# EasyEDA schematic Schematic_AddKEYSTM32_EASYEDA.json
TITLE: addKey; REV: 2.2; Date: 2021-01-10; Sheet: 1/1; Drawn By: Volker Simon; Company: None
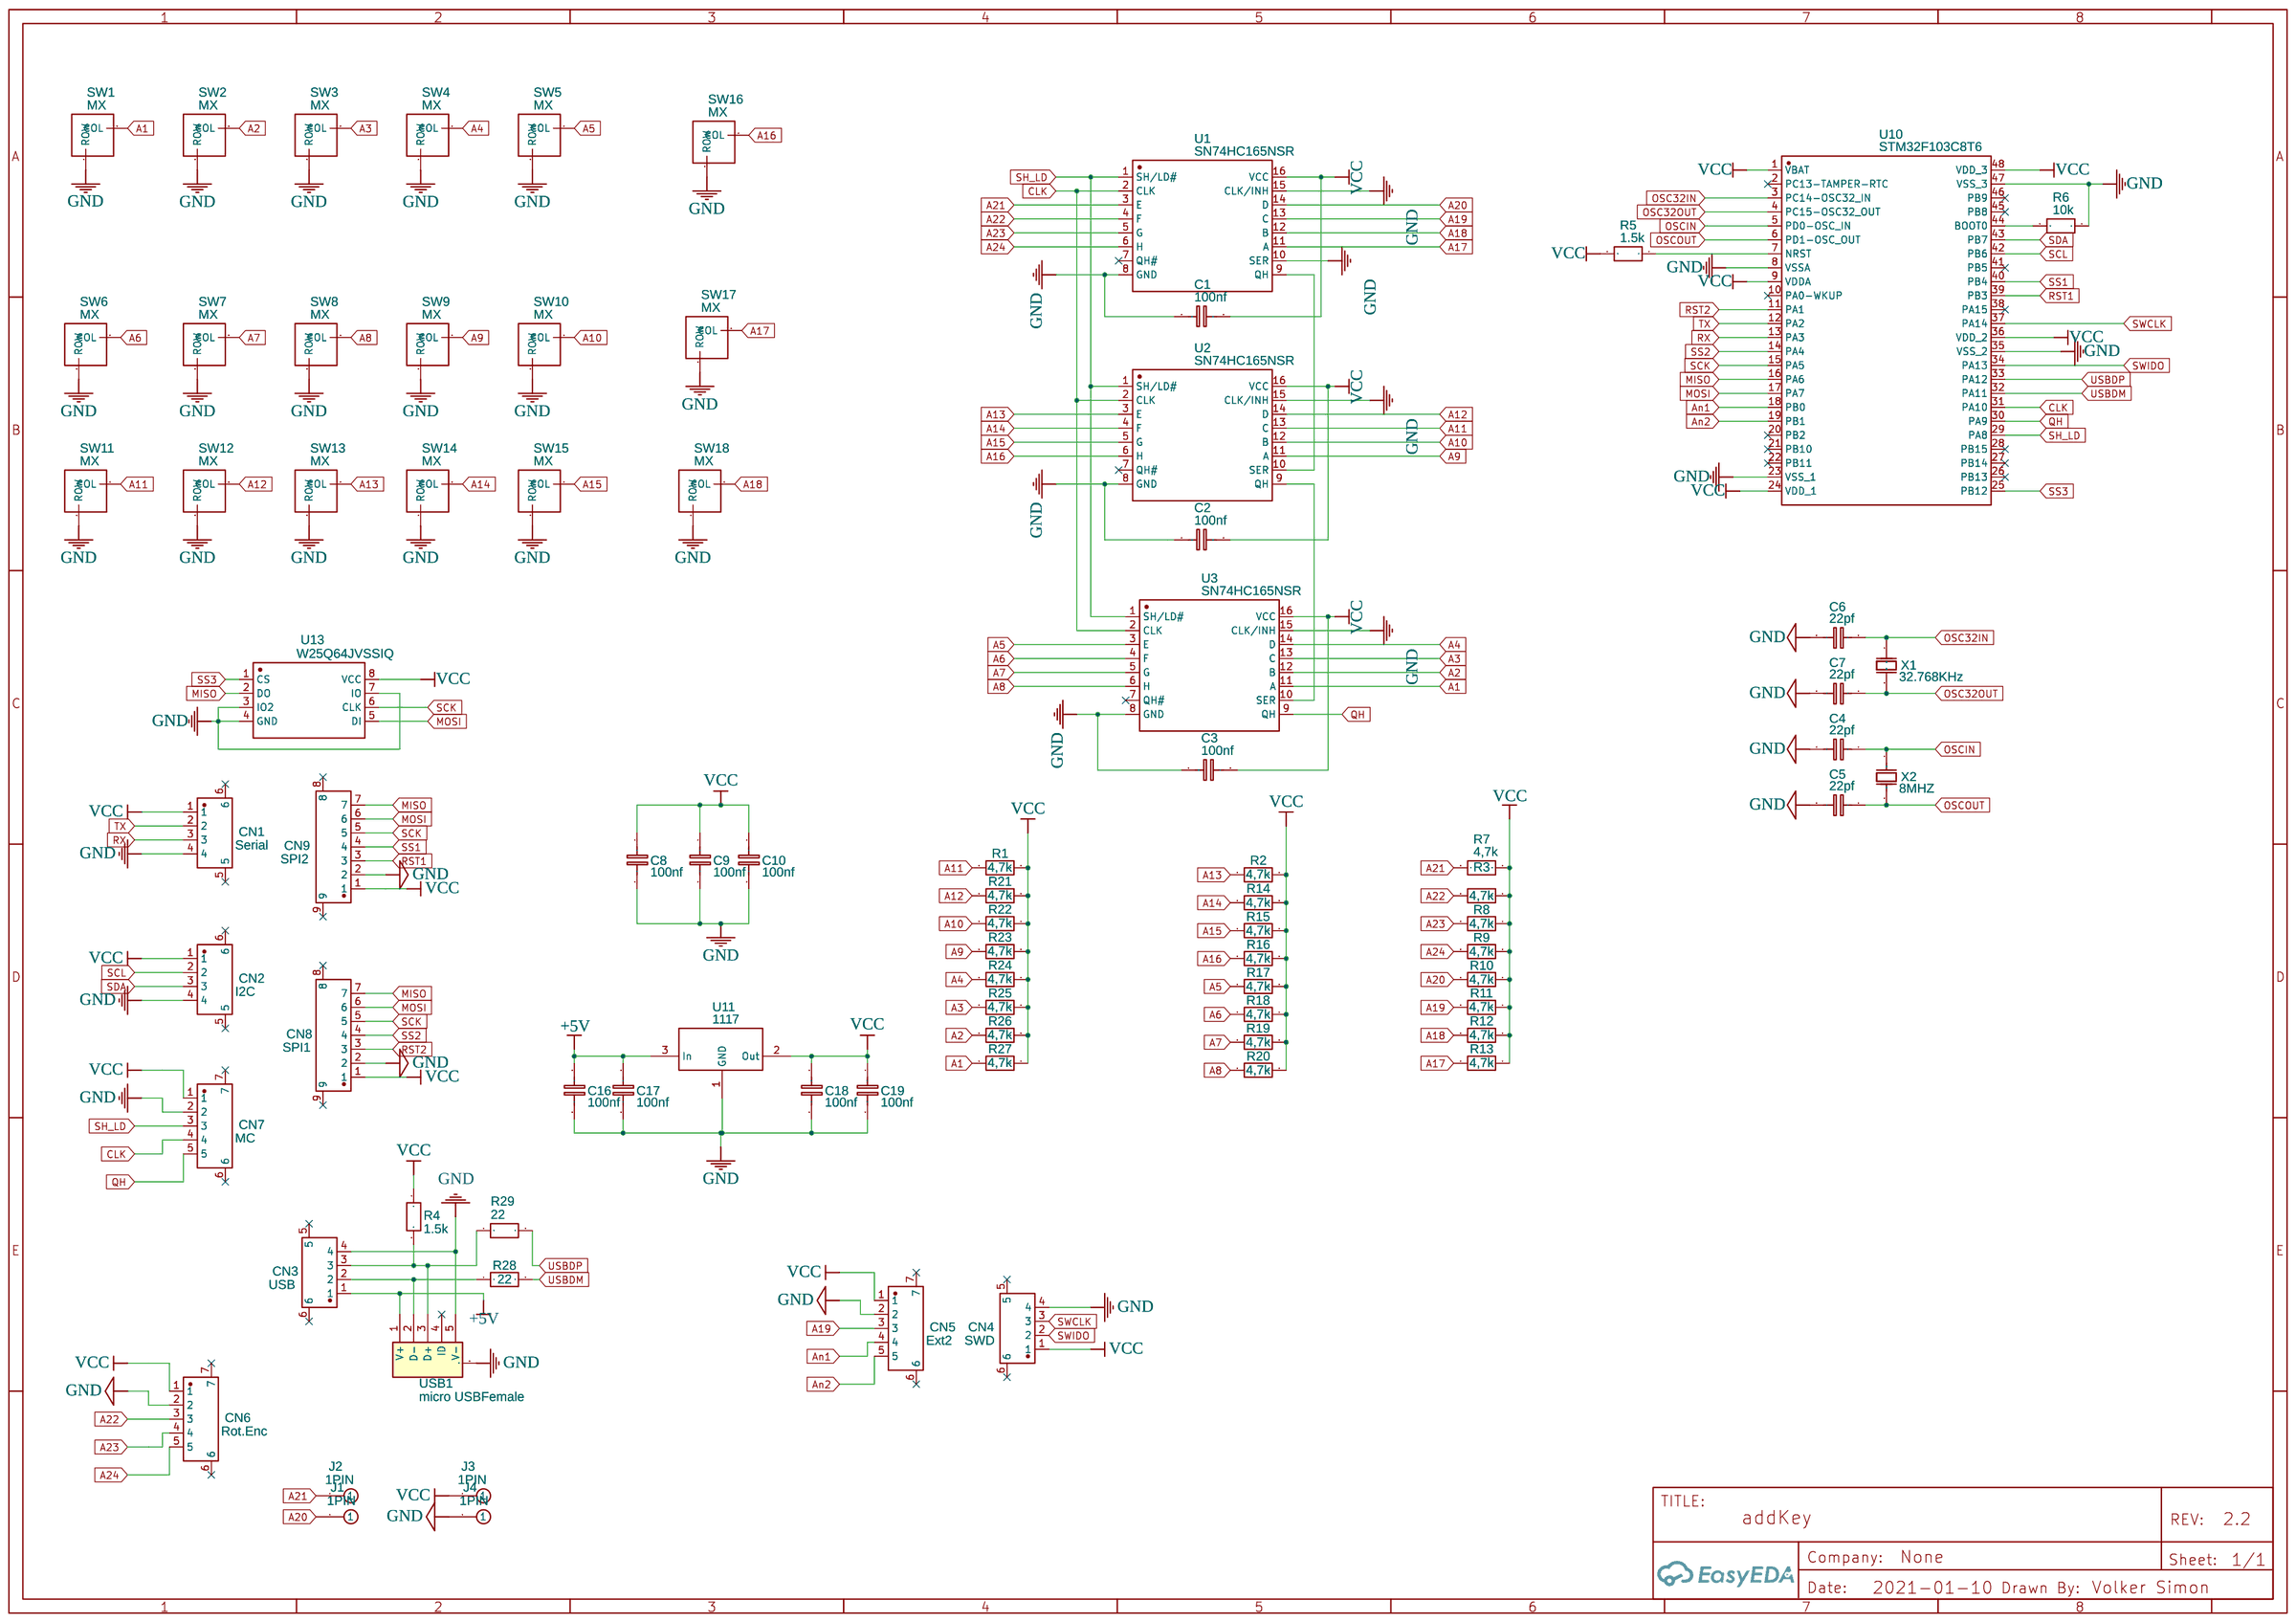
[diagram p0: schematic sheet]

## Parts
C1  100nf  [1206]
C2  100nf  [1206]
C3  100nf  [1206]
C4  22pf  [1206]
C5  22pf  [1206]
C6  22pf  [1206]
C7  22pf  [1206]
C8  100nf  [1206]
C9  100nf  [1206]
C10  100nf  [1206]
C16  100nf  [1206]
C17  100nf  [1206]
C18  100nf  [1206]
C19  100nf  [1206]
CN1  Serial  [CONN-SMD_4P-P1.00_X1002WRS-04E-LPSWHF]
CN2  I2C  [CONN-SMD_4P-P1.00_X1002WRS-04E-LPSWHF]
CN3  USB  [CONN-SMD_4P-P1.00_X1002WRS-04E-LPSWHF]
CN4  SWD  [CONN-SMD_4P-P1.00_X1002WRS-04E-LPSWHF]
CN5  Ext2  [CONN-SMD_5P-P1.00_X1002WRS-05E-LPSWHF]
CN6  Rot.Enc  [CONN-SMD_5P-P1.00_X1002WRS-05E-LPSWHF]
CN7  MC  [CONN-SMD_5P-P1.00_X1002WRS-05E-LPSWHF]
CN8  SPI1  [CONN-SMD_7P-P1.00_X1002WRS-07E-LPSWHF]
CN9  SPI2  [CONN-SMD_7P-P1.00_X1002WRS-07E-LPSWHF]
J1  1PIN  [1PIN]
J2  1PIN  [1PIN]
J3  1PIN  [1PIN]
J4  1PIN  [1PIN]
R1  4,7k  [R1206]
R2  4,7k  [R1206]
R3  4,7k  [R1206]
R4  1.5k  [R1206]
R5  1.5k  [R1206]
R6  10k  [R1206]
R7  4,7k  [R1206]
R8  4,7k  [R1206]
R9  4,7k  [R1206]
R10  4,7k  [R1206]
R11  4,7k  [R1206]
R12  4,7k  [R1206]
R13  4,7k  [R1206]
R14  4,7k  [R1206]
R15  4,7k  [R1206]
R16  4,7k  [R1206]
R17  4,7k  [R1206]
R18  4,7k  [R1206]
R19  4,7k  [R1206]
R20  4,7k  [R1206]
R21  4,7k  [R1206]
R22  4,7k  [R1206]
R23  4,7k  [R1206]
R24  4,7k  [R1206]
R25  4,7k  [R1206]
R26  4,7k  [R1206]
R27  4,7k  [R1206]
R28  22  [R1206]
R29  22  [R1206]
SW1  MX  [CHERRY MX SWITCH 1.0U]
SW2  MX  [CHERRY MX SWITCH 1.0U]
SW3  MX  [CHERRY MX SWITCH 1.0U]
SW4  MX  [CHERRY MX SWITCH 1.0U]
SW5  MX  [CHERRY MX SWITCH 1.0U]
SW6  MX  [CHERRY MX SWITCH 1.0U]
SW7  MX  [CHERRY MX SWITCH 1.0U]
SW8  MX  [CHERRY MX SWITCH 1.0U]
SW9  MX  [CHERRY MX SWITCH 1.0U]
SW10  MX  [CHERRY MX SWITCH 1.0U]
SW11  MX  [CHERRY MX SWITCH 1.0U]
SW12  MX  [CHERRY MX SWITCH 1.0U]
SW13  MX  [CHERRY MX SWITCH 1.0U]
SW14  MX  [CHERRY MX SWITCH 1.0U]
SW15  MX  [CHERRY MX SWITCH 1.0U]
SW16  MX  [CHERRY MX SWITCH 1.0U]
SW17  MX  [CHERRY MX SWITCH 1.0U]
SW18  MX  [CHERRY MX SWITCH 1.0U]
U1  SN74HC165NSR  [SOP-16_208MIL]
U2  SN74HC165NSR  [SOP-16_208MIL]
U3  SN74HC165NSR  [SOP-16_208MIL]
U10  STM32F103C8T6  [LQFP-48_L7.0-W7.0-P0.50-LS9.0-BL]
U11  1117  [AMS_1117]
U13  W25Q64JVSSIQ  [SOP-8_208MIL]
USB1  micro USBFemale  [MICRO-USB-SMD_5P-P0.65-H-F_C10418]
X1  32.768KHz  [OSC-TH_BD2.0-P0.70-D0.3]
X2  8MHZ  [HC-49S_L11.0-W4.6-P4.88]

## Library data of the parts
C1-C3 C8-C10 C16-C19 = Cap_1206_EU: Manufacturer Part: 1206F104M500NT; Supplier: LCSC; Manufacturer: Guangdong Fenghua Advanced Tech; Supplier Part: C313097
C4-C7 = Cap_1206_EU: Manufacturer Part: 1206CG220J102NT; Supplier: LCSC; Manufacturer: Guangdong Fenghua Advanced Tech; Supplier Part: C313096
CN1-CN4 = X1002WRS-04E-LPSWHF: Supplier: LCSC; Supplier Part: C437064; Manufacturer: XKB Enterprise; Contributor: LCSC
CN5-CN7 = X1002WRS-05E-LPSWHF: Supplier: LCSC; Supplier Part: C437065; Manufacturer: XKB Enterprise; Contributor: LCSC
CN8 CN9 = X1002WRS-07E-LPSWHF: Supplier: LCSC; Supplier Part: C437067; Manufacturer: XKB Enterprise; Contributor: LCSC
J1-J4 = 1PIN: Contributor: JoshuaFireseed
R1-R3 R7-R27 = Res_AXIAL-0.3(1/8W)_EU: Manufacturer Part: 1206W4F4701T5E; Package Display: No; Supplier: LCSC; Manufacturer: UniOhm; Supplier Part: C17936
R4-R6 R28 R29 = Res_AXIAL-0.3(1/8W)_EU: Package Display: No
SW1-SW18 = CHERRY MX SWITCH 1.0U: Manufacturer Part: Cherry; Supplier Part: CH310-ND; Supplier: Digi-Key; Contributor: logan.howard.macfarl
U1-U3 = -: Supplier: LCSC; Manufacturer: TI; Supplier Part: C129935
U10 = STM32F103C8T6: Supplier: LCSC; Manufacturer: STMicroelectronics; LCSC Assembly: Yes; image: //image.lceda.cn/szlcsc/C8734.jpg; Supplier Part: C8734; SMT Type: Basic
U11 = 1117: sourceId: dwIGgezVh; Supplier Part: C6186; Supplier: LCSC; Manufacturer: AMS; Manufacturer Part: AMS1117-5.0; Contributor: ssllvv
U13 = W25Q64JVSSIQ: Supplier Part: C83140; Supplier: LCSC; Manufacturer: WINBOND; Contributor: VladV
USB1 = micro USBFemale: Supplier: LCSC; Manufacturer: ValuePro; image: //image.lceda.cn/szlcsc/C10418.jpg; Supplier Part: C10418
X1 = DT-26-32.768K-6PF-20PPM: Supplier: LCSC; Supplier Part: C127496; Manufacturer: KDS Daishinku; Manufacturer Part: DT-26-32.768K-6pF-20PPM; Contributor: LCSC
X2 = 49SAC08000182060: Supplier: LCSC; Supplier Part: C390747; Manufacturer: JGHC; Contributor: LCSC

## Nets
+5V: C16.1 C17.1 CN3.1 U11.3(In) USB1.1(V+)
GND: C1.1 C2.1 C3.1 C4.2 C5.2 C6.2 C7.2 C8.2 C9.2 C10.2 C16.2 C17.2 C18.2 C19.2 CN1.4 CN2.4 CN3.4 CN4.4 CN5.2 CN6.2 CN7.2 CN8.2 CN9.2 J4.1 R6.1 SW1.R(ROW) SW2.R(ROW) SW3.R(ROW) SW4.R(ROW) SW5.R(ROW) SW6.R(ROW) SW7.R(ROW) SW8.R(ROW) SW9.R(ROW) SW10.R(ROW) SW11.R(ROW) SW12.R(ROW) SW13.R(ROW) SW14.R(ROW) SW15.R(ROW) SW16.R(ROW) SW17.R(ROW) SW18.R(ROW) U1.8(GND) U1.10(SER) U1.15(CLK/INH) U2.8(GND) U2.15(CLK/INH) U3.8(GND) U3.15(CLK/INH) U10.8(VSSA) U10.23(VSS_1) U10.35(VSS_2) U10.47(VSS_3) U11.1(GND) U13.3(IO2) U13.4(GND) U13.7(IO) USB1.0(MTN) USB1.5(V-)
VCC: C1.2 C2.2 C3.2 C8.1 C9.1 C10.1 C18.1 C19.1 CN1.1 CN2.1 CN4.1 CN5.1 CN6.1 CN7.1 CN8.1 CN9.1 J3.1 R1.1 R2.1 R3.1 R4.1 R5.2 R7.1 R8.1 R9.1 R10.1 R11.1 R12.1 R13.1 R14.1 R15.1 R16.1 R17.1 R18.1 R19.1 R20.1 R21.1 R22.1 R23.1 R24.1 R25.1 R26.1 R27.1 U1.16(VCC) U2.16(VCC) U3.16(VCC) U10.1(VBAT) U10.9(VDDA) U10.24(VDD_1) U10.36(VDD_2) U10.48(VDD_3) U11.2(Out) U13.8(VCC)
A1: R27.2 SW1.C(COL) U3.11(A)
A2: R26.2 SW2.C(COL) U3.12(B)
A3: R25.2 SW3.C(COL) U3.13(C)
A4: R24.2 SW4.C(COL) U3.14(D)
A5: R17.2 SW5.C(COL) U3.3(E)
A6: R18.2 SW6.C(COL) U3.4(F)
A7: R19.2 SW7.C(COL) U3.5(G)
A8: R20.2 SW8.C(COL) U3.6(H)
A9: R23.2 SW9.C(COL) U2.11(A)
A10: R22.2 SW10.C(COL) U2.12(B)
A11: R1.2 SW11.C(COL) U2.13(C)
A12: R21.2 SW12.C(COL) U2.14(D)
A13: R2.2 SW13.C(COL) U2.3(E)
A14: R14.2 SW14.C(COL) U2.4(F)
A15: R15.2 SW15.C(COL) U2.5(G)
A16: R16.2 SW16.C(COL) U2.6(H)
A17: R13.2 SW17.C(COL) U1.11(A)
A18: R12.2 SW18.C(COL) U1.12(B)
A19: CN5.3 R11.2 U1.13(C)
A20: J1.1 R10.2 U1.14(D)
A21: J2.1 R7.2 U1.3(E)
A22: CN6.3 R3.2 U1.4(F)
A23: CN6.4 R8.2 U1.5(G)
A24: CN6.5 R9.2 U1.6(H)
An1: CN5.4 U10.18(PB0)
An2: CN5.5 U10.19(PB1)
CLK: CN7.4 U1.2(CLK) U2.2(CLK) U3.2(CLK) U10.31(PA10)
MISO: CN8.7 CN9.7 U10.16(PA6) U13.2(DO)
MOSI: CN8.6 CN9.6 U10.17(PA7) U13.5(DI)
OSC32IN: C6.1 U10.3(PC14-OSC32_IN) X1.1(OSC1)
OSC32OUT: C7.1 U10.4(PC15-OSC32_OUT) X1.2(OSC2)
OSCIN: C4.1 U10.5(PD0-OSC_IN) X2.1(OSC1)
OSCOUT: C5.1 U10.6(PD1-OSC_OUT) X2.2(OSC2)
QH: CN7.5 U3.9(QH) U10.30(PA9)
RST1: CN9.3 U10.39(PB3)
RST2: CN8.3 U10.11(PA1)
RX: CN1.3 U10.13(PA3)
SCK: CN8.5 CN9.5 U10.15(PA5) U13.6(CLK)
SCL: CN2.2 U10.42(PB6)
SDA: CN2.3 U10.43(PB7)
SH_LD: CN7.3 U1.1(SH/LD#) U2.1(SH/LD#) U3.1(SH/LD#) U10.29(PA8)
SS1: CN9.4 U10.40(PB4)
SS2: CN8.4 U10.14(PA4)
SS3: U10.25(PB12) U13.1(CS)
SWCLK: CN4.3 U10.37(PA14)
SWIDO: CN4.2 U10.34(PA13)
TX: CN1.2 U10.12(PA2)
USBDM: R28.2 U10.32(PA11)
USBDP: R29.2 U10.33(PA12)
Net-(CN3-2): CN3.2 R28.1 USB1.2(D-)
Net-(CN3-3): CN3.3 R4.2 R29.1 USB1.3(D+)
Net-(R5-1): R5.1 U10.7(NRST)
Net-(R6-2): R6.2 U10.44(BOOT0)
Net-(U1-9): U1.9(QH) U2.10(SER)
Net-(U2-9): U2.9(QH) U3.10(SER)

Not connected (* = marked no-connect by the designer): CN1 5* 6*; CN2 5* 6*; CN3 5* 6*; CN4 5* 6*; CN5 6* 7*; CN6 6* 7*; CN7 6* 7*; CN8 8* 9*; CN9 8* 9*; U1 7(QH#)*; U2 7(QH#)*; U3 7(QH#)*; U10 2(PC13-TAMPER-RTC)* 10(PA0-WKUP)* 20(PB2)* 21(PB10)* 22(PB11)* 26(PB13)* 27(PB14)* 28(PB15)* 38(PA15)* 41(PB5)* 45(PB8)* 46(PB9)*; USB1 4(ID)*
